# EAGLE schematic 001 (EAGLE 9.6.2)

## Sheet 1 of 2
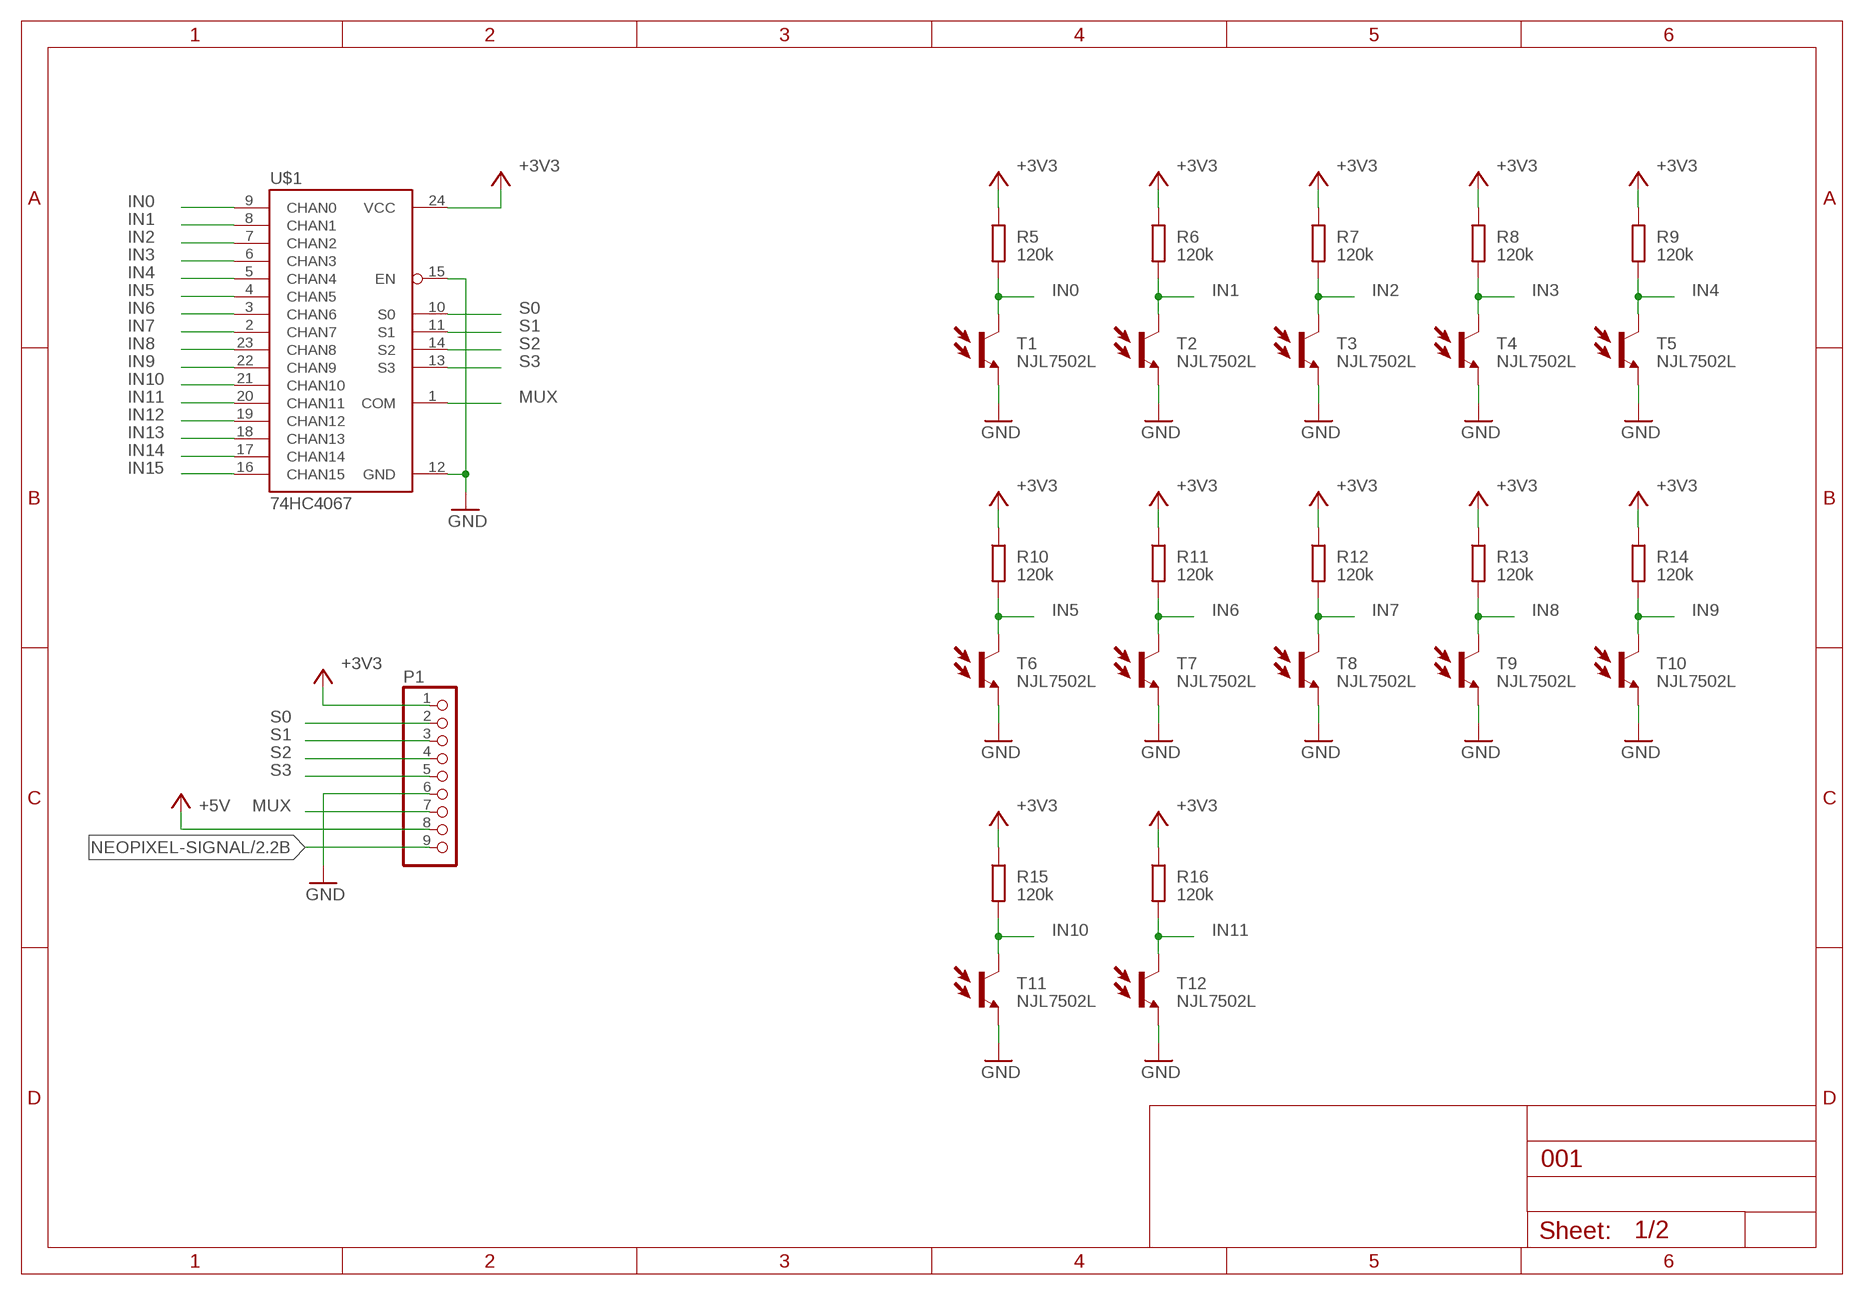
[diagram p0: schematic, sheet 1]

### Parts
P1  S9B-ZR-SM4A-TF  [ZH-SM4-SIDE09]
R5  120k  R-EU_R0805  [R0805]
R6  120k  R-EU_R0805  [R0805]
R7  120k  R-EU_R0805  [R0805]
R8  120k  R-EU_R0805  [R0805]
R9  120k  R-EU_R0805  [R0805]
R10  120k  R-EU_R0805  [R0805]
R11  120k  R-EU_R0805  [R0805]
R12  120k  R-EU_R0805  [R0805]
R13  120k  R-EU_R0805  [R0805]
R14  120k  R-EU_R0805  [R0805]
R15  120k  R-EU_R0805  [R0805]
R16  120k  R-EU_R0805  [R0805]
T1  NJL7502L  MYPARTS_NJL7502L  [MYPARTS_NJL7502L]
T2  NJL7502L  MYPARTS_NJL7502L  [MYPARTS_NJL7502L]
T3  NJL7502L  MYPARTS_NJL7502L  [MYPARTS_NJL7502L]
T4  NJL7502L  MYPARTS_NJL7502L  [MYPARTS_NJL7502L]
T5  NJL7502L  MYPARTS_NJL7502L  [MYPARTS_NJL7502L]
T6  NJL7502L  MYPARTS_NJL7502L  [MYPARTS_NJL7502L]
T7  NJL7502L  MYPARTS_NJL7502L  [MYPARTS_NJL7502L]
T8  NJL7502L  MYPARTS_NJL7502L  [MYPARTS_NJL7502L]
T9  NJL7502L  MYPARTS_NJL7502L  [MYPARTS_NJL7502L]
T10  NJL7502L  MYPARTS_NJL7502L  [MYPARTS_NJL7502L]
T11  NJL7502L  MYPARTS_NJL7502L  [MYPARTS_NJL7502L]
T12  NJL7502L  MYPARTS_NJL7502L  [MYPARTS_NJL7502L]
U$1  74HC4067  SPARKFUN_MUX-74HC4067SMD  [SPARKFUN_SSOP24]

### Nets
+3V3: P1.1 R5.1 R6.1 R7.1 R8.1 R9.1 R10.1 R11.1 R12.1 R13.1 R14.1 R15.1 R16.1 U$1.24(VCC)
+5V: P1.8 ; also sheet 2
GND: P1.6 T1.E T2.E T3.E T4.E T5.E T6.E T7.E T8.E T9.E T10.E T11.E T12.E U$1.12(GND) U$1.15(EN) ; also sheet 2
IN0: R5.2 T1.C U$1.9(CHAN0)
IN1: R6.2 T2.C U$1.8(CHAN1)
IN2: R7.2 T3.C U$1.7(CHAN2)
IN3: R8.2 T4.C U$1.6(CHAN3)
IN4: R9.2 T5.C U$1.5(CHAN4)
IN5: R10.2 T6.C U$1.4(CHAN5)
IN6: R11.2 T7.C U$1.3(CHAN6)
IN7: R12.2 T8.C U$1.2(CHAN7)
IN8: R13.2 T9.C U$1.23(CHAN8)
IN9: R14.2 T10.C U$1.22(CHAN9)
IN10: R15.2 T11.C U$1.21(CHAN10)
IN11: R16.2 T12.C U$1.20(CHAN11)
IN12: U$1.19(CHAN12)
IN13: U$1.18(CHAN13)
IN14: U$1.17(CHAN14)
IN15: U$1.16(CHAN15)
MUX: P1.7 U$1.1(COM)
NEOPIXEL-SIGNAL: P1.9 ; also sheet 2
S0: P1.2 U$1.10(S0)
S1: P1.3 U$1.11(S1)
S2: P1.4 U$1.14(S2)
S3: P1.5 U$1.13(S3)

## Sheet 2 of 2: NeoPixels
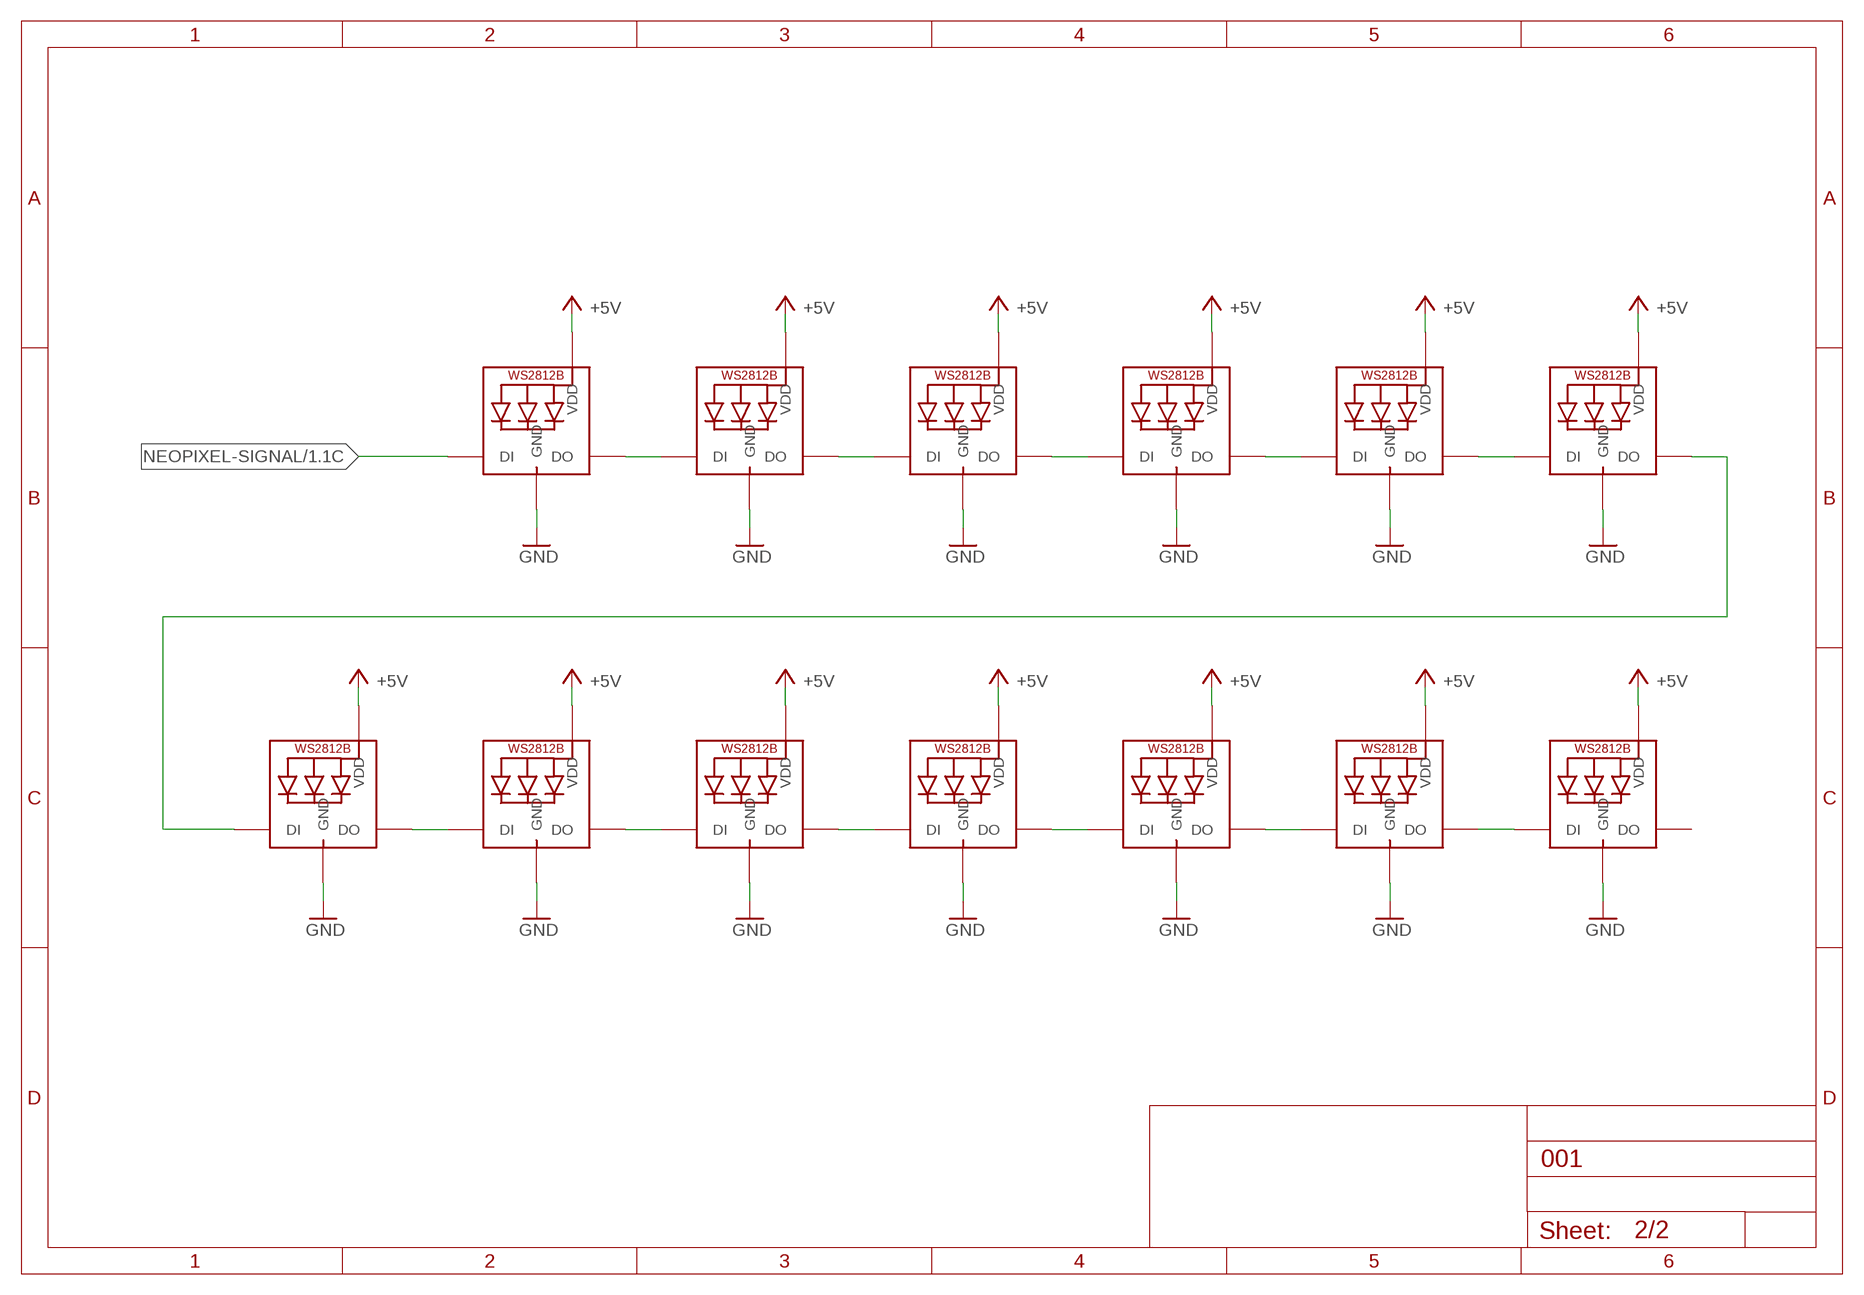
[diagram p1: schematic, sheet 2]

### Parts
LED1  WS2812B5050  [WS2812B]
LED2  WS2812B5050  [WS2812B]
LED3  WS2812B5050  [WS2812B]
LED4  WS2812B5050  [WS2812B]
LED5  WS2812B5050  [WS2812B]
LED6  WS2812B5050  [WS2812B]
LED7  WS2812B5050  [WS2812B]
LED8  WS2812B5050  [WS2812B]
LED9  WS2812B5050  [WS2812B]
LED10  WS2812B5050  [WS2812B]
LED11  WS2812B5050  [WS2812B]
LED12  WS2812B5050  [WS2812B]
LED13  WS2812B5050  [WS2812B]

### Nets
+5V: LED1.1-VDD(VDD) LED2.1-VDD(VDD) LED3.1-VDD(VDD) LED4.1-VDD(VDD) LED5.1-VDD(VDD) LED6.1-VDD(VDD) LED7.1-VDD(VDD) LED8.1-VDD(VDD) LED9.1-VDD(VDD) LED10.1-VDD(VDD) LED11.1-VDD(VDD) LED12.1-VDD(VDD) LED13.1-VDD(VDD) ; also sheet 1
GND: LED1.3-GND(GND) LED2.3-GND(GND) LED3.3-GND(GND) LED4.3-GND(GND) LED5.3-GND(GND) LED6.3-GND(GND) LED7.3-GND(GND) LED8.3-GND(GND) LED9.3-GND(GND) LED10.3-GND(GND) LED11.3-GND(GND) LED12.3-GND(GND) LED13.3-GND(GND) ; also sheet 1
N$1: LED2.2-DOUT(DO) LED3.4-DIN(DI)
N$2: LED1.2-DOUT(DO) LED2.4-DIN(DI)
N$3: LED3.2-DOUT(DO) LED4.4-DIN(DI)
N$4: LED4.2-DOUT(DO) LED5.4-DIN(DI)
N$5: LED5.2-DOUT(DO) LED6.4-DIN(DI)
N$6: LED6.2-DOUT(DO) LED7.4-DIN(DI)
N$7: LED7.2-DOUT(DO) LED8.4-DIN(DI)
N$8: LED8.2-DOUT(DO) LED9.4-DIN(DI)
N$9: LED9.2-DOUT(DO) LED10.4-DIN(DI)
N$10: LED10.2-DOUT(DO) LED11.4-DIN(DI)
N$11: LED11.2-DOUT(DO) LED12.4-DIN(DI)
N$13: LED12.2-DOUT(DO) LED13.4-DIN(DI)
NEOPIXEL-SIGNAL: LED1.4-DIN(DI) ; also sheet 1
Unconnected: LED13.2-DOUT(DO)

## Library data of the parts
LED1-LED13 = microbuilder:WS2812B
P1 = zh:S9B-ZR-SM4A-TF
R5-R16 = rcl:R-EU_: RESISTOR, European symbol; SPICEPREFIX: R
T1-T12 = #001-line:MYPARTS_NJL7502L
U$1 = Analog-Digital-Mux-Breakout:SPARKFUN_MUX-74HC4067

## Net classes
0 default: width 0.203 mm